# Altium schematic sheet Sheet2.SchDoc: G2 Lab Supply
size A3; Revision: 1B
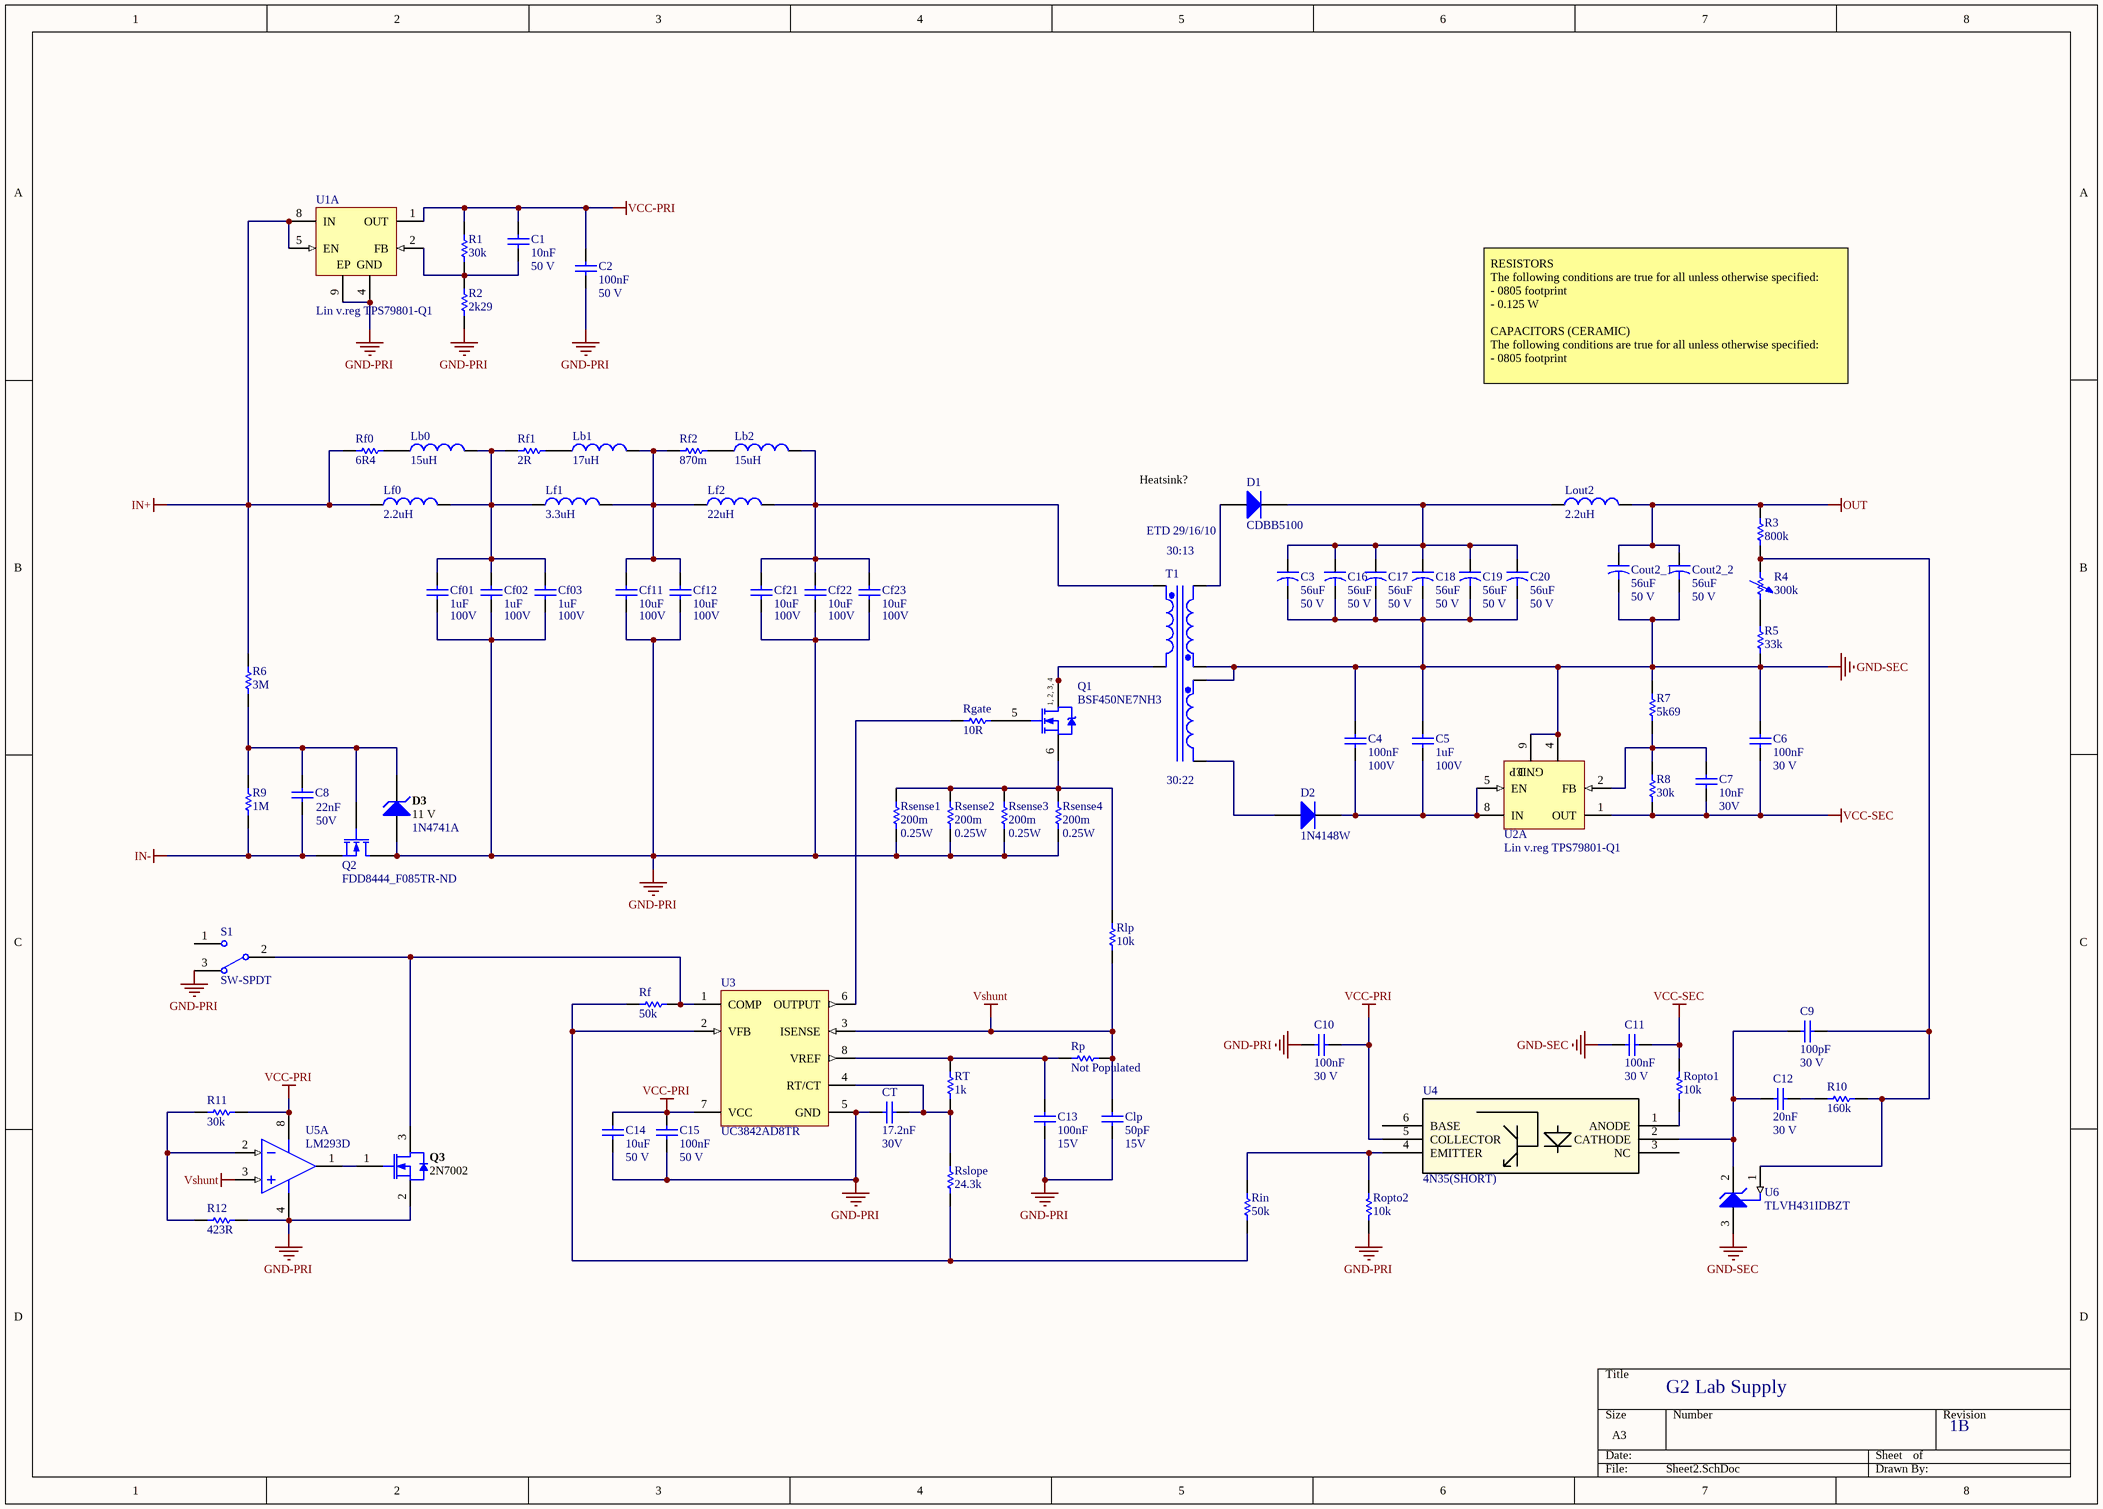
[diagram p0: Sheet2.SchDoc]

## Parts
C1  10nF  Rated Voltage: 50 V  [CAPC0805(2012)145_N]
C2  100nF  Rated Voltage: 50 V  [CAPC0805(2012)145_N]
C3  value 56uF  Voltage - Rated: 50 V  [CAPR5-4X5]  (hidden comment: Cap2)
C4  100nF  Rated Voltage: 100V  [CAPC0805(2012)145_N]
C5  1uF  Voltage - Rated: 100V  [CAPC3216X180X20LL20]
C6  100nF  Rated Voltage: 30 V  [CAPC0805(2012)145_N]
C7  10nF  Rated Voltage: 30V  [CAPC0805(2012)145_N]
C8  22nF  Rated Voltage: 50V  [CAPC0805(2012)145_N]
C9  100pF  Rated Voltage: 30 V  [CAPC0805(2012)145_N]
C10  100nF  Rated Voltage: 30 V  [CAPC0805(2012)145_N]
C11  100nF  Rated Voltage: 30 V  [CAPC0805(2012)145_N]
C12  20nF  Rated Voltage: 30 V  [CAPC0805(2012)145_N]
C13  100nF  Rated Voltage: 15V  [CAPC0805(2012)145_N]
C14  10uF  Rated Voltage: 50 V  [CAPC0805(2012)145_N]
C15  100nF  Rated Voltage: 50 V  [CAPC0805(2012)145_N]
C16  value 56uF  Voltage - Rated: 50 V  [CAPR5-4X5]  (hidden comment: Cap2)
C17  value 56uF  Voltage - Rated: 50 V  [CAPR5-4X5]  (hidden comment: Cap2)
C18  value 56uF  Voltage - Rated: 50 V  [CAPR5-4X5]  (hidden comment: Cap2)
C19  value 56uF  Voltage - Rated: 50 V  [CAPR5-4X5]  (hidden comment: Cap2)
C20  value 56uF  Voltage - Rated: 50 V  [CAPR5-4X5]  (hidden comment: Cap2)
Cf01  1uF  Voltage - Rated: 100V  [CAPC3216X180X20LL20]
Cf02  1uF  Voltage - Rated: 100V  [CAPC3216X180X20LL20]
Cf03  1uF  Voltage - Rated: 100V  [CAPC3216X180X20LL20]
Cf11  10uF  Voltage - Rated: 100V  [CAPC5750X250X20LL40]
Cf12  10uF  Voltage - Rated: 100V  [CAPC5750X250X20LL40]
Cf21  10uF  Voltage - Rated: 100V  [CAPC5750X250X20LL40]
Cf22  10uF  Voltage - Rated: 100V  [CAPC5750X250X20LL40]
Cf23  10uF  Voltage - Rated: 100V  [CAPC5750X250X20LL40]
Clp  50pF  Rated Voltage: 15V  [CAPC0805(2012)145_N]
Cout2_1  value 56uF  Voltage - Rated: 50 V  [CAPR5-4X5]  (hidden comment: Cap2)
Cout2_2  value 56uF  Voltage - Rated: 50 V  [CAPR5-4X5]
CT  17.2nF  Rated Voltage: 30V  [CAPC0805(2012)145_N]
D1  CDBB5100  [SMC]
D2  1N4148W  [JSCJ-SOD-123-2_V]
D3  11 V  PartNumber: 1N4741A  [FAIR-DO-41-2_V]
Lb0  15uH
Lb1  17uH
Lb2  15uH
Lf0  2.2uH
Lf1  3.3uH
Lf2  22uH
Lout2  2.2uH
Q1  BSF450NE7NH3  [INF-MG-WDSON-2-1_V]
Q2  FDD8444_F085TR-ND
Q3  2N7002  [INF-PG-SOT23_M]
R1  30k  [RESC0805(2012)_L]
R2  2k29  [RESC0805(2012)_L]
R3  800k  [RESC0805(2012)_L]
R4  300k  [AXIAL-0.7]
R5  33k  [RESC0805(2012)_L]
R6  3M  [RESC0805(2012)_L]
R7  5k69  [RESC0805(2012)_L]
R8  30k  [RESC0805(2012)_L]
R9  1M  [RESC0805(2012)_L]
R10  160k  [RESC0805(2012)_L]
R11  30k  [RESC0805(2012)_L]
R12  423R  [RESC0805(2012)_L]
Rf  50k  [RESC0805(2012)_L]
Rf0  6R4  [RESC0805(2012)_L]
Rf1  2R  [RESC0805(2012)_L]
Rf2  870m  [RESC0805(2012)_L]
Rgate  10R  [RESC0805(2012)_L]
Rin  50k  [RESC0805(2012)_L]
Rlp  10k  [RESC0805(2012)_L]
Ropto1  10k  [RESC0805(2012)_L]
Ropto2  10k  [RESC0805(2012)_L]
Rp  Not Populated  [RESC0805(2012)_L]
Rsense1  200m  Power: 0.25W  [RESC0805(2012)_L]
Rsense2  200m  Power: 0.25W  [RESC0805(2012)_L]
Rsense3  200m  Power: 0.25W  [RESC0805(2012)_L]
Rsense4  200m  Power: 0.25W  [RESC0805(2012)_L]
Rslope  24.3k  [RESC0805(2012)_L]
RT  1k  [RESC0805(2012)_L]
S1  SW-SPDT  [TL36WW15050]
T1  ETD 29/16/10, Turns ratio 30:13:22  [ETD 29/16/10 v2]  (value not drawn)
U1  Lin v.reg TPS79801-Q1  [DGN0008B_N]  (part A of 2)
U2  Lin v.reg TPS79801-Q1  [DGN0008B_N]  (part A of 2)
U3  UC3842AD8TR  [D0008A_L]
U4  4N35(SHORT)  [4N35]
U5  LM293D  [D0008A_M]  (part A of 2)
U6  TLVH431IDBZT  [TI-DBZ3_N]

## Nets
GND-PRI: C2.1 C10.1 C13.2 C14.1 C15.1 Cf01.1 Cf02.1 Cf03.1 Cf11.1 Cf12.1 Cf21.1 Cf22.1 Cf23.1 Clp.1 CT.2 D3.1(A) Q2.1(D) Q3.2(SOURCE) R2.1 R12.2 Ropto2.1 Rsense1.1 Rsense2.1 Rsense3.1 Rsense4.1 S1.3 U1.4(GND) U1.9(EP) U3.5(GND) U5.4(GND)
GND-SEC: C3.2 C4.2 C5.2 C6.2 C11.1 C16.2 C17.2 C18.2 C19.2 C20.2 Cout2_1.2 Cout2_2.2 R5.1 R7.1 T1.3(Sec1+) T1.5(Sec2+) U2.4(GND) U2.9(EP) U6.3(ANODE)
IN+: Lf0.1 R6.2 Rf0.2 U1.5(EN) U1.8(IN)
IN-: C8.1 Q2.3(S) R9.1
OUT: Cout2_1.1 Cout2_2.1 Lout2.2 R3.2
VCC-PRI: C1.2 C2.2 C10.2 C14.2 C15.2 R1.2 R11.2 U1.1(OUT) U3.7(VCC) U4.5(COLLECTOR) U5.8(VCC)
VCC-SEC: C6.1 C7.1 C11.2 R8.2 Ropto1.1 U2.1(OUT)
Vshunt: Clp.2 Rlp.2 Rp.2 U3.3(ISENSE) U5.3(IN1+)
NetC1_1: C1.1 R1.1 R2.2 U1.2(FB)
NetC3_1: C3.1 C16.1 C17.1 C18.1 C19.1 C20.1 D1.2(K) Lout2.1
NetC4_1: C4.1 C5.1 D2.2(-) U2.5(EN) U2.8(IN)
NetC7_2: C7.2 R7.2 R8.1 U2.2(FB)
NetC8_2: C8.2 D3.2(K) Q2.2(G) R6.1 R9.2
NetC9_1: C9.1 C12.1 U4.2(CATHODE) U6.2(CATHODE)
NetC9_2: C9.2 R3.1 R4.1 R10.1 U6.1(REF)
NetC12_2: C12.2 R10.2
NetC13_1: C13.1 Rp.1 RT.2 U3.8(VREF)
NetCf01_2: Cf01.2 Cf02.2 Cf03.2 Lb0.2 Lf0.2 Lf1.1 Rf1.2
NetCf11_2: Cf11.2 Cf12.2 Lb1.2 Lf1.2 Lf2.1 Rf2.2
NetCf21_2: Cf21.2 Cf22.2 Cf23.2 Lb2.2 Lf2.2 T1.1(Pri+)
NetCT_1: CT.1 Rslope.1 RT.1 U3.4(RT/CT)
NetD1_1: D1.1(A) T1.4(Sec1-)
NetD2_1: D2.1(+) T1.6(Sec2-)
NetLb0_1: Lb0.1 Rf0.1
NetLb1_1: Lb1.1 Rf1.1
NetLb2_1: Lb2.1 Rf2.1
NetQ1_1: Q1.1(DRAIN) Q1.2(DRAIN) Q1.3(DRAIN) Q1.4(DRAIN) T1.2(Pri-)
NetQ1_5: Q1.5(GATE) Rgate.1
NetQ1_6: Q1.6(SOURCE) Rlp.1 Rsense1.2 Rsense2.2 Rsense3.2 Rsense4.2
NetQ3_1: Q3.1(GATE) U5.1(OUT1)
NetQ3_3: Q3.3(DRAIN) Rf.1 S1.2 U3.1(COMP)
NetR4_2: R4.2 R5.2
NetR11_1: R11.1 R12.1 U5.2(IN1-)
NetRf_2: Rf.2 Rin.2 Rslope.2 U3.2(VFB)
NetRgate_2: Rgate.2 U3.6(OUTPUT)
NetRin_1: Rin.1 Ropto2.2 U4.4(EMITTER)
NetRopto1_2: Ropto1.2 U4.1(ANODE)

Not connected (* = marked no-connect by the designer): S1 1; U4 3(NC) 6(BASE)

## Notes on the sheet
- RESISTORS
  The following conditions are true for all unless otherwise specified:
  - 0805 footprint
  - 0.125 W
  CAPACITORS (CERAMIC)
  The following conditions are true for all unless otherwise specified:
  - 0805 footprint
- (near D1) Heatsink?
- ETD 29/16/10
- (near T1) 30:13
- (near T1) 30:22
- (in symbol CMP-1091-00001-1) 1, 2, 3, 4

## Library data of the parts
C1 C2 C6-C15 Clp CT = CMP-1036-04379-1: CAP 82nF; Case-EIA: 0805; Case-Metric: 2012; Tolerance: Â±10%; Value: 82nF; Technology: SMT; Max Thickness: 1.45 mm
C3 C16-C20 Cout2_1 Cout2_2 = Cap2: Capacitor; Published: 23-Sep-2002; PackageReference: CAPR5-4X5; Publisher: Altium Limited; PackageDescription: Capacitor; 2 Leads
C4 = CMP-1036-04379-1: footprint not correct; Value: 82nF; Case-EIA: 0805; Case-Metric: 2012; Tolerance: Â±10%; Technology: SMT; Max Thickness: 1.45 mm
C5 Cf01 Cf02 Cf03 = CMP-2000-06049-1: Chip Capacitor, 1 uF, +/- 10%, 100 V, -55 to 125 degC, 1206 (3216 Metric), RoHS, Tape and Reel; Manufacturer: TDK; PCN Part Number: MLCCPartNumberChange30/Nov/2012; Kits: SAMPLEKIT1008-ND-KITCAPCERMLCC100V-630V; Product Training Modules: SEAT,CCV,andTVCLDesignToolsGuidetoReplacinganElectrolyticCapacitorwithanMLCC; Capacitance: 1µF; Featured Product: C-SeriesMidVoltageMLCCs; Other Names: 445-4467-1; Catalog Drawings: CSERIES_1206_1.8; Online Catalog: CSeries,MidVoltage; Temperature Coefficient: X7R; Features: -; Family: CeramicCapacitors; Datasheet URL: http://www.farnell.com/datasheets/1484596.pdf; Mounting Technology: SurfaceMount; Mounting Type: SurfaceMount,MLCC; Datasheet Version: 08/2011; Standard Package: 1; Package / Case: 1206(3216Metric); Applications: GeneralPurpose; Package Reference: 1206; Operating Temperature: -55°C~125°C; Packaging: CutTape(CT); Package Description: 2-Pin Surface Mount Device, Body 3.2 x 1.6 mm; Ratings: -; Series: C; Tolerance: ±10%; Manufacturer URL: http://www.tdk.com/; Lead Spacing: -; Height - Seated (Max): -; Package URL: https://product.tdk.com/info/en/documents/chara_sheet/C3216X7R1V106K160AC.pdf; Lead Style: -; Category: Capacitors; RoHS Information: RoHSCertificate-MLCC
Cf11 Cf12 Cf21-Cf23 = CMP-2000-07445-1: Chip Capacitor, 10 uF, +/- 10%, 100 V, -55 to 125 degC, 2220 (5750 Metric), RoHS, Tape and Reel; Manufacturer: TDK; Package Description: 2-Pin Surface Mount Device, Body 5.7 x 5 mm; Package Reference: 2220; Mounting Technology: SurfaceMount; Datasheet URL: https://product.tdk.com/info/en/catalog/datasheets/mlcc_automotive_midvoltage_en.pdf; Datasheet Version: 03/2015; Manufacturer URL: http://www.tdk.com/
D1 = Diode: Default Diode; Published: 8-Jun-2000; LatestRevisionDate: 17-Jul-2002; LatestRevisionNote: Re-released for DXP Platform.; PackageVersion: Sep-1996; PackageReference: SMC; Publisher: Altium Limited; PackageDescription: DO-214-AB/SMC; 2 C-Bend Leads; Body 7.9 x 5.9 mm, inc. leads (LxW); Code_JEDEC: DO-214-AB
D2 = CMP-0914-00001-1: Fast Switching Diode, 75 V, 150 mA, 2-Pin 2.7 x 1.6 x 1.25 mm SMD, Tape and Reel; Manufacturer: Changjiang Electronics; TSTG (degC): -55 to 150; IR (uA): 1; VR (V): 75; VF (V): 1.25; PD (mW): 350; Trr (ns): 4; IO (mA): 150; Packing: Tape and Reel; ComponentLink2URL: http://www.cj-elec.com/txUpfile/20121613352740313.pdf; PackageReference: SOD-123-2; PackageVersion: Rev. A; DatasheetVersion: Rev. A; ComponentLink3Description: Package Specification; ComponentLink3URL: http://www.cj-elec.com/txUpfile/201412112231195145.pdf; ComponentLink1Description: Manufacturer URL; ComponentLink1URL: http://www.cj-elec.com/; PartNumber: 1N4148W; ComponentLink2Description: Datasheet; PackageDescription: 2-Pin SMD, Body 2.7 x 1.6 mm, Height 1.25 mm; Mounting Technology: Surface Mount
D3 = CMP-0892-00002-1: Zener Diode, 11V, 1W, 5%, -65 to 200 degC, 2-Pin DO-41, Body 2.72 x 5.2 mm, RoHS; Manufacturer: Fairchild Semiconductor; PD (W): 1; VZ (Min.) (V): 10.45; VZ (Max.) (V): 11.55; Test Current IZ (mA): 23; ZZ (Max) (ohm): 7; IR (uA): 5; ComponentLink3URL: http://www.fairchildsemi.com/dwg/DO/DO41A.pdf; ComponentLink2Description: Datasheet; ComponentLink3Description: Package Specification; ComponentLink2URL: http://www.fairchildsemi.com/ds/1N/1N4744A.pdf; PackageVersion: Rev. 2; RoHS: TRUE; DatasheetVersion: Rev. H3; Mounting Technology: Through Hole; Operating and Storage Temperature Range: -65 to 200 degC; PackageReference: DO-41-2; ComponentLink1URL: http://www.fairchildsemi.com/; ComponentLink1Description: Manufacturer URL; Tolerance: 5%; PackageDescription: 2-Pin Axial leaded, Body 2.72 x 5.2 mm, Lead Spread 25.4 mm
Lb0-Lb2 Lf0-Lf2 Lout2 = Inductor: Code_IEC: 1005; Value: 10mH; Published: 8-Jun-2000; LatestRevisionDate: 29-May-2009; LatestRevisionNote: IPC-7351 Footprint Added.; PackageReference: 0402-A; Publisher: Altium Limited; PackageDescription: Chip Inductor; Code_JEITA: 0402
Q1 = CMP-1091-00001-1: N-Channel OptiMOS 3 Power-MOSFET, 75 V VDS, 15 A ID, -40 to 150 degC, MG-WDSON-2-1, Reel, Green; Manufacturer: Infineon; RthJA (max): 58Â K/W; RDS (on) (max): 45Â mOhm; Polarity: N; VDS (max): 75Â V; Green: TRUE; ID (max): 15Â A; Rth: 7Â K/W; QG: 6Â nC; Ptot (max): 18Â W; VGS(th) (min): 2.3Â V; IDpuls (max): 60Â A; VGS(th) (max): 3.5Â V; ComponentLink1Description: Manufacturer URL; Mounting Technology: Surface Mount; PackageReference: MG-WDSON-2-1; PackageVersion: Rev. 02, 05/2009; ComponentLink2URL: http://www.infineon.com/dgdl/BSF450NE7NH3G_rev2.pdf?folderId=db3a304313b8b5a60113cee8763b02d7&fileId=db3a30433a047ba0013a687e2ae403da; ComponentLink3URL: http://www.infineon.com/dgdl/BSF450NE7NH3G_rev2.0.pdf?folderId=db3a304313b8b5a60113cee8763b02d7&fileId=db3a30433a047ba0013a687e2ae403da; DatasheetVersion: Rev. 2.0; ComponentLink3Description: Package Specification; ComponentLink2Description: Datasheet; PartNumber: BSF450NE7NH3; Halogen-free: TRUE; Packing: Reel; RthJC (max): 7Â K/W; PackageDescription: 6-Pin Metal Green Very Very Thin Profile Dual Small Outline Non-Leaded Package; ComponentLink1URL: http://www.infineon.com/
Q2 = MOSFET-N: Published: 8-Jun-2000; LatestRevisionDate: 17-Jul-2002; LatestRevisionNote: Re-released for DXP Platform.; PackageVersion: 1995/1996; PackageReference: E3; Publisher: Altium Limited; PackageDescription: TO, Flat Index; 3 In-Line, Axial Leads; Body Dia. 4.6mm; Lead Dia. 0.5 mm (max)
Q3 = CMP-1149-00026-1: N-Channel OptiMOS Small-Signal-Transistor, 60 V VDS, 0.3 A ID, -55 to 150 degC, PG-SOT23, Reel, Green; Manufacturer: Infineon; RDS (on) (max) (@4.5V): 4,000 mOhm; VDS (max): 60 V; IDpuls (max): 1.2Â A; QG: 0.4Â nC; RDS (on) (max): 3,000 mOhm; RthJA (max): 250 K/W; ID (max): 0.3Â A; VGS(th) (max): 2.5Â V; VGS(th) (min): 1.5Â V; Green: TRUE; Ptot (max): 0.5Â W; PackageDescription: 3-Pin Small Outline Transistor Package, 2.9 x 1.3 mm Body, 0.95 mm Pitch; Halogen-free: TRUE; ComponentLink2Description: Datasheet; ComponentLink1URL: http://www.infineon.com/; Packing: Reel; DatasheetVersion: Rev. 2.4; PartNumber: 2N7002; PackageReference: PG-SOT23; PackageVersion: Apr-08; ComponentLink3URL: http://www.infineon.com/dgdl/SOT23-Package_Overview.pdf?folderId=db3a30431936bc4b0119532290053c66&fileId=db3a30431936bc4b0119533468123c85; ComponentLink1Description: Manufacturer URL; Mounting Technology: Surface Mount; ComponentLink3Description: Package Specification; ComponentLink2URL: http://www.infineon.com/dgdl/2N7002_Rev2.4.pdf?folderId=db3a3043156fd573011622e10b5c1f67&fileId=db3a304319bc939a0119c2a9461e79e6
R1-R3 R5-R12 Rf Rf1 Rf2 Rgate Rin Rlp Ropto1 Ropto2 Rslope RT = CMP-1013-00736-1: Value: 100000.00 Ohm; Tolerance: 1 %; Case-Metric: 2012; Power: 0.125 W; Case-EIA: 0805; Technology: SMT
R4 = Res Adj1: Variable Resistor; Value: 50K; Set Position: 0.5; Published: 8-Jun-2000; LatestRevisionDate: 17-Jul-2002; LatestRevisionNote: Re-released for DXP Platform.; PackageReference: AXIAL-0.7; Publisher: Altium Limited; PackageDescription: Axial Device, Thru-Hole; 2 Leads; 0.7 in Pin Spacing
Rf0 = CMP-1013-00736-1: Value: 6.4 Ohm; Tolerance: 1 %; Case-Metric: 2012; Power: 0.125 W; Case-EIA: 0805; Technology: SMT
Rp = CMP-1013-00736-1: Biasing current sense; Value: 100000.00 Ohm; Tolerance: 1 %; Case-Metric: 2012; Power: 0.125 W; Case-EIA: 0805; Technology: SMT
Rsense1-Rsense4 = CMP-1013-00736-1: wrong footprint; Value: 100000.00 Ohm; Tolerance: 1 %; Case-Metric: 2012; Case-EIA: 0805; Technology: SMT
S1 = SW-SPDT: SPDT Subminiature Toggle Switch, Right Angle Mounting, Vertical Actuation; Published: 24-Mar-1999; LatestRevisionDate: 17-Dec-2003; LatestRevisionNote: Schematic revised, PCB Footprint replaced.; DatasheetVersion: 05-Dec-2000; PackageReference: TL36WW15050; Publisher: Altium Limited; PackageDescription: Switch; 4 Leads; ComponentLink1Description: Manufacturer Link; ComponentLink1URL: http://www.apem.com
T1 = Trans3: Three-winding Transformer (Non-Ideal)
U1 U2 = CMP-0394-01260-2: got this footprint from a similar model; Manufacturer: Texas Instruments; PartNumber: TPS79801QDGNRQ1; Iq(Typ)(mA): 0.04; Vout Adj(Min)(V): 1.275; Iout(Max)(A): 0.05; Vout Adj(Max)(V): 28; Vdo(Typ)(mV): 300; Vin(Max)(V): 50; Eco-Plan: Green (RoHS & no Sb/Br); SubFamily: Single Channel LDO; Vin(Min)(V): 3; Accuracy(%): 1.5; ComponentLink2URL: http://www.ti.com/general/docs/lit/getliterature.tsp?genericPartNumber=TPS79801-Q1&fileType=pdf; Code_JEDEC: MO-187; ComponentLink2Description: Datasheet; PackageDescription: 8-Pin Plastic Small Outline, Body 3 x 3 mm, Pitch 0.65 mm; ComponentLink1URL: http://www.ti.com/; PackageVersion: 4073271/F; Mounting Technology: Surface Mount; ComponentLink1Description: Manufacturer URL; DatasheetVersion: SLVS822D; ComponentLink3URL: http://www.ti.com/litv/pdf/mpds046e; PackageReference: DGN0008B; ComponentLink3Description: Package Specification
U3 = CMP-0319-00555-2: PWM Controller with Current Control, 100 % Duty Cycle, 0 to +70 degC, 8-pin SOIC (D), Green (RoHS & no Sb/Br); Manufacturer: Texas Instruments; Rating: Catalog; Topology: Boost, Buck, Flyback, Forward; Regulated Outputs(#): 1; Duty Cycle(Max)(%): 100; UVLO Thresholds On/Off(V): 16/10; Frequency(Max)(kHz): 450; ComponentLink1Description: Datasheet; ComponentLink1URL: http://www.ti.com/general/docs/lit/getliterature.tsp?genericPartNumber=UC3842A&fileType=pdf; Mounting Technology: Surface Mount; PartNumber: UC3842AD8TR; Control Method: Current; PackageDescription: 8-Pin Plastic Small Outline Integrated Circuit, 4.9 x 3.9 mm, Pitch 1.27 mm Pitch; DatasheetVersion: SLUS224C; PackageVersion: revM, Jun-2011; Code_JEDEC: MS-012AA; PackageReference: D0008A; Eco-Plan: Green (RoHS & no Sb/Br); SubFamily: PWM Controller
U4 = 4N35(SHORT): Imported; Vendor: Toshiba; Built_By: EMA_UL_Team; C: Copyright (C) 2015 Accelerated Designs. All rights reserved; Manufacturer_Part_Number: 4N35(SHORT); Value: Value; Type: Type; RefDes: RefDes
U5 = CMP-2100-03650-1: Dual Differential Comparator, 2 to 30 V, -25 to 85 degC, 8-Pin SOIC (D), Green (RoHS & no Sb/Br), Tube; Manufacturer: Texas Instruments; Supply Voltage: 28V; Max Supply Current: 500uA; Max Dual Supply Voltage: 18V; Input Offset Voltage (Vos): 5mV; Output Current: 20mA; Package Version: 4040047-3/M, 06/2011; Min Dual Supply Voltage: 1V; Max Supply Voltage: 36V; Voltage Gain: 106.02dB; Input Bias Current: 250nA; Output Current per Channel: 6mA; Number of Channels: 2; Min Supply Voltage: 2V; Nominal Supply Current: 1mA; Quiescent Current: 2.5mA; Package Description: 8-Pin Small Outline Integrated Circuit, Body 4.9 x 3.9 mm, Pitch 1.27 mm; Width: 3.91mm; Packaging: Rail/Tube; Length: 4.9mm; Min Operating Temperature: -25degC; Package Reference: D0008A; Radiation Hardening: No; Datasheet Version: SLCS005Y, 06/2015; Lead Free: LeadFree; Package URL: http://www.ti.com/lit/ml/msoi002j/msoi002j.pdf; Datasheet URL: http://www.ti.com/general/docs/lit/getliterature.tsp?genericPartNumber=LM293&fileType=pdf; Manufacturer URL: http://www.ti.com/; Number of Pins: 8; REACH SVHC: NoSVHC; Height: 1.58mm; RoHSCompliant: true; Mount: SurfaceMount; Package Quantity: 75; Max Operating Temperature: 85degC; Case/Package: SOIC; Max Input Current: 250nA; Number of Elements: 2; Weight: 0.002561oz; PartId: 1
U6 = CMP-0366-00941-1: Low-Voltage Adjustable Precision Shunt Regulator, 80 mA, -40 to 85 degC, 3-pin SOT-23 (DBZ), Green (RoHS & no Sb/Br); Manufacturer: Texas Instruments; SubFamily: Shunt Voltage Reference; VO Adj(Max)(V): 18; Temp Coeff(Max)(ppm/ degree C): 129; Rating: Catalog; Initial Accuracy @ 25/deg C(%): 1.5; Min Iz for Regulation(uA): 80; VO Adj(Min)(V): 1.24; PackageDescription: 3-Pin Plastic Small Outline, Body 2.92 x 1.3 mm, Pitch 0.95 mm; ComponentLink1Description: Manufacturer URL; Mounting Technology: Surface Mount; PartNumber: TLVH431IDBZT; PackageVersion: 4203227/B; Code_JEDEC: TO-236; ComponentLink1URL: http://www.ti.com/; ComponentLink2URL: http://www.ti.com/general/docs/lit/getliterature.tsp?genericPartNumber=TLVH431&fileType=pdf; DatasheetVersion: SLVS555I; PackageReference: DBZ3; Iout/Iz(Max)(mA): 80; ComponentLink3Description: Package Specification; Eco-Plan: Green (RoHS & no Sb/Br); ComponentLink3URL: http://www.ti.com/litv/pdf/mpds108a; ComponentLink2Description: Datasheet